# EAGLE design jphy_pwr.v1 (EAGLE 6.1)
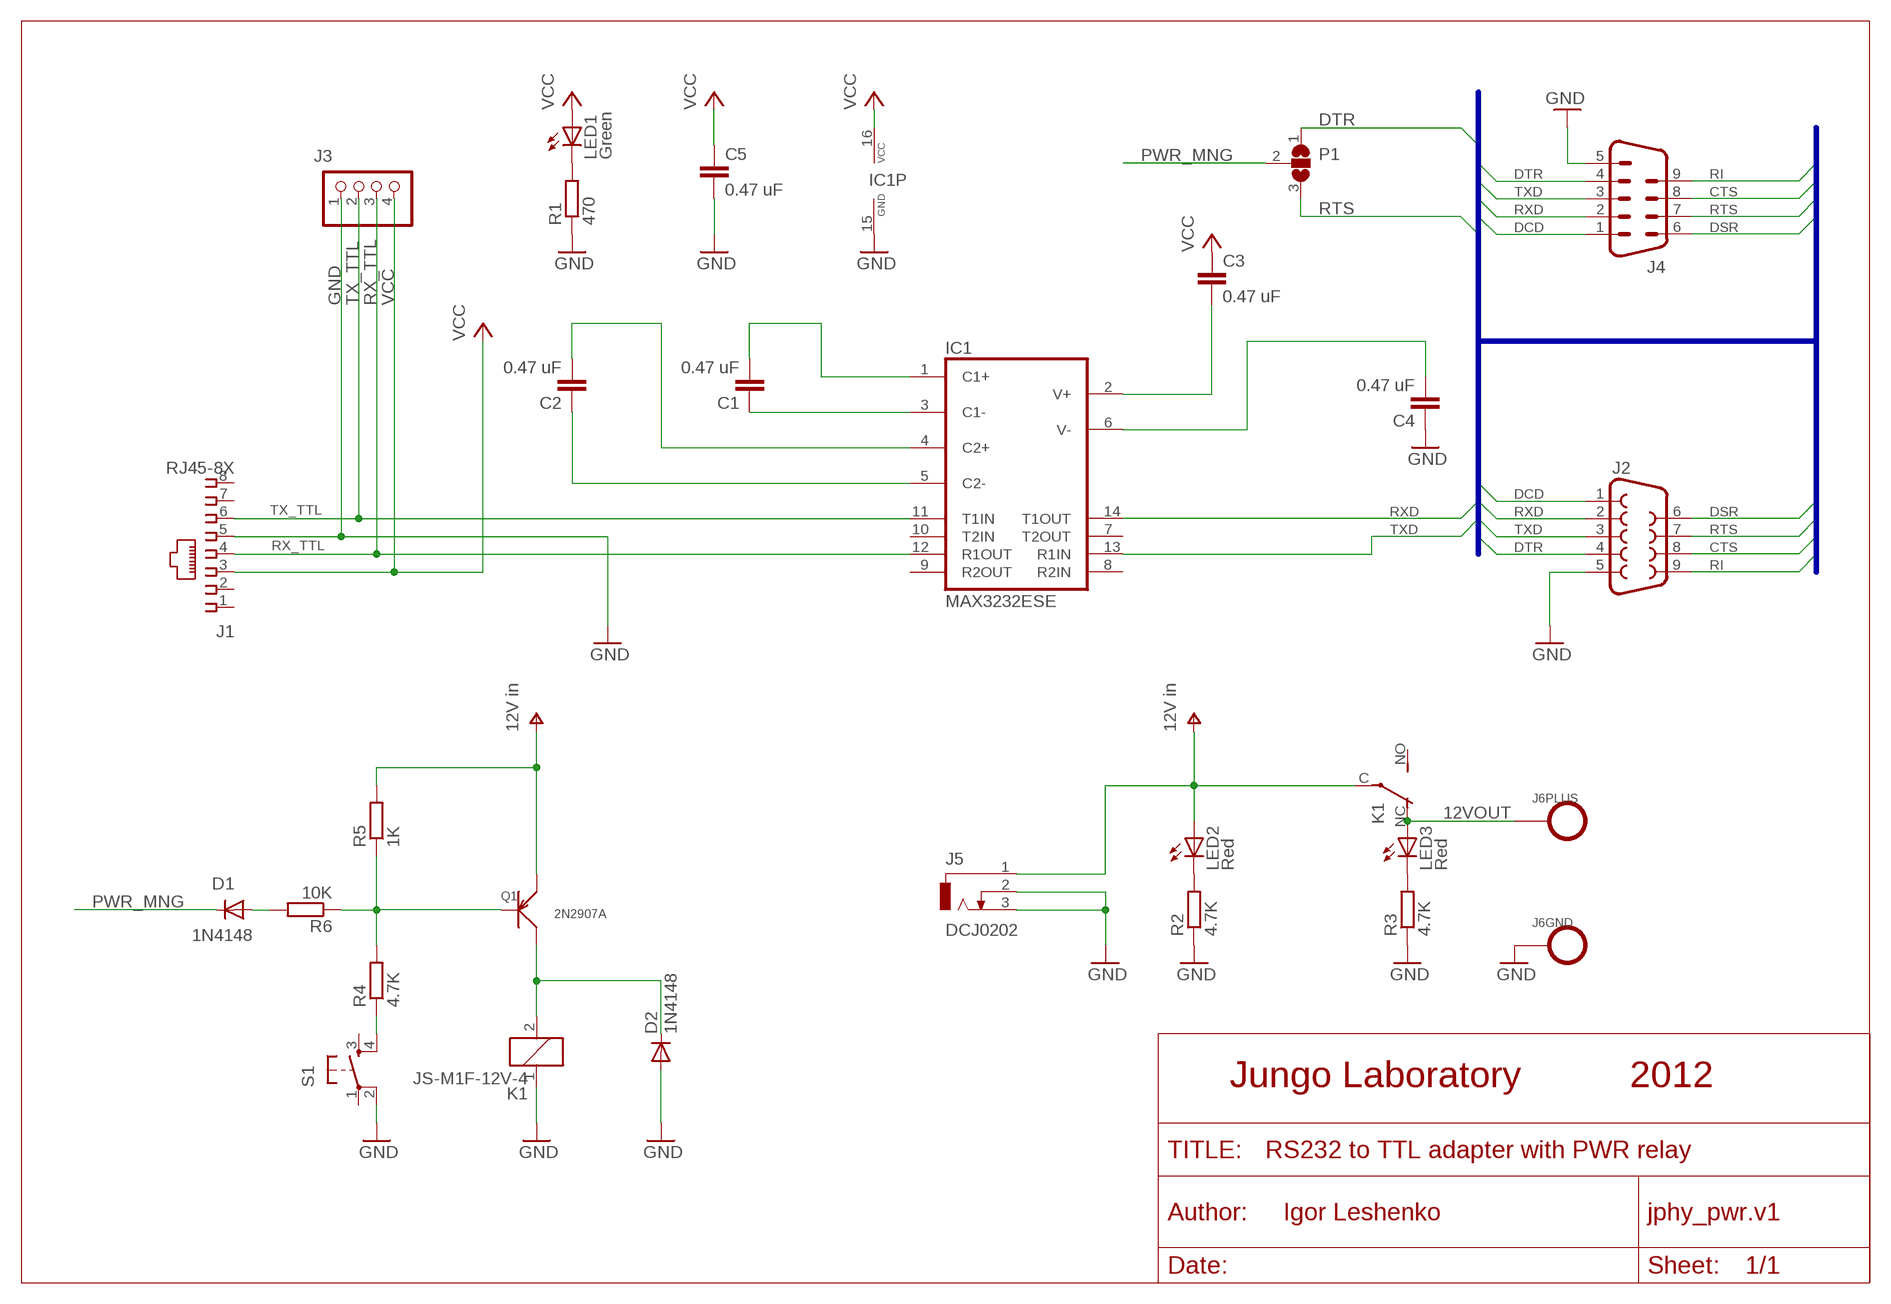
[diagram p0: schematic, sheet 1]

## Parts
C1  0.47 uF  C-EUC0805  [C0805]
C2  0.47 uF  C-EUC0805  [C0805]
C3  0.47 uF  C-EUC0805  [C0805]
C4  0.47 uF  C-EUC0805  [C0805]
C5  0.47 uF  C-EUC1206  [C1206]
D1  1N4148  DIODE-D-5  [D-5]
D2  1N4148  DIODE-D-5  [D-5]
IC1  MAX3232ESE  [SO16]
J1  RJ45-8X  [RJ45-NO-SHIELD]
J2  F09D  [F09D]
J3  PINHD-1X4  [1X04]
J4  M09D  [M09D]
J5  DCJ0202  [DCJ0202]
J6  POWER-OUT  [FLEX-POWER]
K1  JS-M1F-12V-4  [JS-M]
LED1  Green  LED3MM  [LED3MM]
LED2  Red  LED3MM  [LED3MM]
LED3  Red  LED3MM  [LED3MM]
P1  PAD-SOLDERJUMPER-2WAYT  [3P-SMD-4.8X2]
Q1  2N2907A  TRANSISTOR-PNP-TO-92  [TO-92-TRIANGLE]
R1  470  R-EU_0207/2V  [0207/2V]
R2  4.7K  R-EU_0207/2V  [0207/2V]
R3  4.7K  R-EU_0207/2V  [0207/2V]
R4  4.7K  R-EU_0207/2V  [0207/2V]
R5  1K  R-EU_0207/2V  [0207/2V]
R6  10K  R-EU_0207/2V  [0207/2V]
S1  TAC_SWITCHPTH  [TACTILE-PTH]

## Nets
12VOUT [power]: J6.1 K1.NC(2:O) LED3.A
+12V [power]: J5.1 K1.C(2:P) LED2.A Q1.1(E) R5.2 ; supply symbol labelled 12V in
CTS [wires]: J2.8 J4.8
DCD [wires]: J2.1 J4.1
DSR [wires]: J2.6 J4.6
DTR: J2.4 J4.4 P1.1
GND [power]: C4.1 C5.2 D2.A IC1.15(GND) J1.5 J2.5 J3.1 J4.5 J5.2 J5.3 J6.2 K1.1 R1.1 R2.1 R3.1 S1.2
N$1: LED1.K(C) R1.2
N$2: C3.2 IC1.2(V+)
N$3: C4.2 IC1.6(V-)
N$4: C1.1 IC1.3(C1-)
N$5: C1.2 IC1.1(C1+)
N$6: C2.1 IC1.5(C2-)
N$7: C2.2 IC1.4(C2+)
N$8: LED2.K(C) R2.2
N$9: LED3.K(C) R3.2
N$10: D2.C K1.2 Q1.3(C)
N$11: R4.1 S1.4
N$13: D1.A R6.2
N$14: Q1.2(B) R4.2 R5.1 R6.1
PWR_MNG: D1.C P1.2
RI [wires]: J2.9 J4.9
RTS: J2.7 J4.7 P1.3
RX_TTL: IC1.12(R1OUT) J1.4 J3.3
RXD: IC1.14(T1OUT) J2.2 J4.2
TX_TTL: IC1.11(T1IN) J1.6 J3.2
TXD: IC1.13(R1IN) J2.3 J4.3
VCC [power]: C3.1 C5.1 IC1.16(VCC) J1.3 J3.4 LED1.A
Unconnected: IC1.7(T2OUT) IC1.8(R2IN) IC1.9(R2OUT) IC1.10(T2IN) J1.1 J1.2 J1.7 J1.8 K1.NO(2:S) S1.1 S1.3

## Buses
DCD,RXD,TXD,DTR,DSR,RTS,CTS,RI

## Notes on the sheet
- 2012
- RS232 to TTL adapter with PWR relay
- Igor Leshenko

## Library data of the parts
C1-C5 = rcl:C-EU: CAPACITOR, European symbol
D1 D2 = diode:DIODE-: DIODE
IC1 = maxim:MAX3232*: True RS-232 Transceivers 3.0V to 5.5V, Low-Power up to 1Mbps, Using Four 0.1µF External Capacitors Source: http://pdfserv.maxim-ic.com/en/ds/MAX3222-MAX3241.pdf; MF: MAXIM; MPN: MAX3232ESE; OC_FARNELL: 9725539; OC_NEWARK: 79C3880
J1 = jlab:RJ45: CORCOM Modular RJ Jacks No Shield Source: www.tycoelectronics.com .. ENG_DS_1654001_1099_RJ_L_0507.pdf; MPN: RJ45-8X; OC_FARNELL: unknown; OC_NEWARK: 16R6101
J2 = con-subd:F09: SUB-D; OC_FARNELL: unknown; OC_NEWARK: unknown
J3 = pinhead:PINHD-1X4: PIN HEADER
J4 = jlab:M09: SUB-D; OC_FARNELL: unknown; OC_NEWARK: unknown
J5 = con-jack:DCJ0202: DC POWER JACK Source: DCJ0202.pdf; OC_FARNELL: unknown; OC_NEWARK: unknown
J6 = jlab:POWER-OUT
K1 = relay:JS-M1*: Automotive Ultra-Miniature Power Relay NAiS Source: http://www.mew-europe.com/.. en_ds_61211_0000.pdf; OC_FARNELL: unknown; OC_NEWARK: unknown
LED1-LED3 = led:LED: LED OSRAM: - CHIPLED LG R971, LG N971, LY N971, LG Q971, LY Q971, LO R971, LY R971 LH N974, LH R974 LS Q976, LO Q976, LY Q976 LO Q996 - Hyper CHIPLED LW Q18S LB Q993, LB Q99A, LB R99A - SideLED LS A670, LO A670, LY A670, LG A670, LP A670 LB A673, LV A673, LT A673, LW A673 LH A674 LY A675 LS A676, LA A676, LO A676, LY A676, LW A676 LS A679, LY A679, LG A679 - Hyper Micro SIDELED® LS Y876, LA Y876, LO Y876, LY Y876 LT Y87S - SmartLED LW L88C, LW L88S LB L89C, LB L89S, LG L890 LS L89K, LO L89K, LY L89K LS L896, LA L896, LO L896, LY L896 - TOPLED LS T670, LO T670, LY T670, LG T670, LP T670 LSG T670, LSP T670, LSY T670, LOP T670, LYG T670 LG T671, LOG T671, LSG T671 LB T673, LV T673, LT T673, LW T673 LH T674 LS T676, LA T676, LO T676, LY T676, LB T676, LH T676, LSB T676, LW T676 LB T67C, LV T67C, LT T67C, LS T67K, LO T67K, LY T67K, LW E67C LS E67B, LA E67B, LO E67B, LY E67B, LB E67C, LV E67C, LT E67C LW T67C LS T679, LY T679, LG T679 LS T770, LO T770, LY T770, LG T770, LP T770 LB T773, LV T773, LT T773, LW T773 LH T774 LS E675, LA E675, LY E675, LS T675 LS T776, LA T776, LO T776, LY T776, LB T776 LHGB T686 LT T68C, LB T68C - Hyper Mini TOPLED® LB M676 - Mini TOPLED Santana® LG M470 LS M47K, LO M47K, LY M47K Source: http://www.osram.convergy.de LUXEON: - LUMILED® LXK2-PW12-R00, LXK2-PW12-S00, LXK2-PW14-U00, LXK2-PW14-V00 LXK2-PM12-R00, LXK2-PM12-S00, LXK2-PM14-U00 LXK2-PE12-Q00, LXK2-PE12-R00, LXK2-PE12-S00, LXK2-PE14-T00, LXK2-PE14-U00 LXK2-PB12-K00, LXK2-PB12-L00, LXK2-PB12-M00, LXK2-PB14-N00, LXK2-PB14-P00, LXK2-PB14-Q00 LXK2-PR12-L00, LXK2-PR12-M00, LXK2-PR14-Q00, LXK2-PR14-R00 LXK2-PD12-Q00, LXK2-PD12-R00, LXK2-PD12-S00 LXK2-PH12-R00, LXK2-PH12-S00 LXK2-PL12-P00, LXK2-PL12-Q00, LXK2-PL12-R00 Source: www.luxeon.com KINGBRIGHT: KA-3528ASYC Source: www.kingbright.com
P1 = Discrete:PAD-SOLDERJUMPER-2WAY: Solder Jumper 2 way solder jumper
Q1 = Discrete:TRANSISTOR-PNP*: PNP audion
R1-R6 = rcl:R-EU_: RESISTOR, European symbol
S1 = SparkFun:TAC_SWITCH: Momentary Switch Button commonly used for reset or general input. Spark Fun Electronics SKU : COM-00097

## Net classes
0 default: width 0.254 mm, drill 0.5 mm, clearance 0.254 mm
1 power: width 0.813 mm, clearance 0.406 mm
2 wires: width 0.254 mm, clearance 0.254 mm

## Board
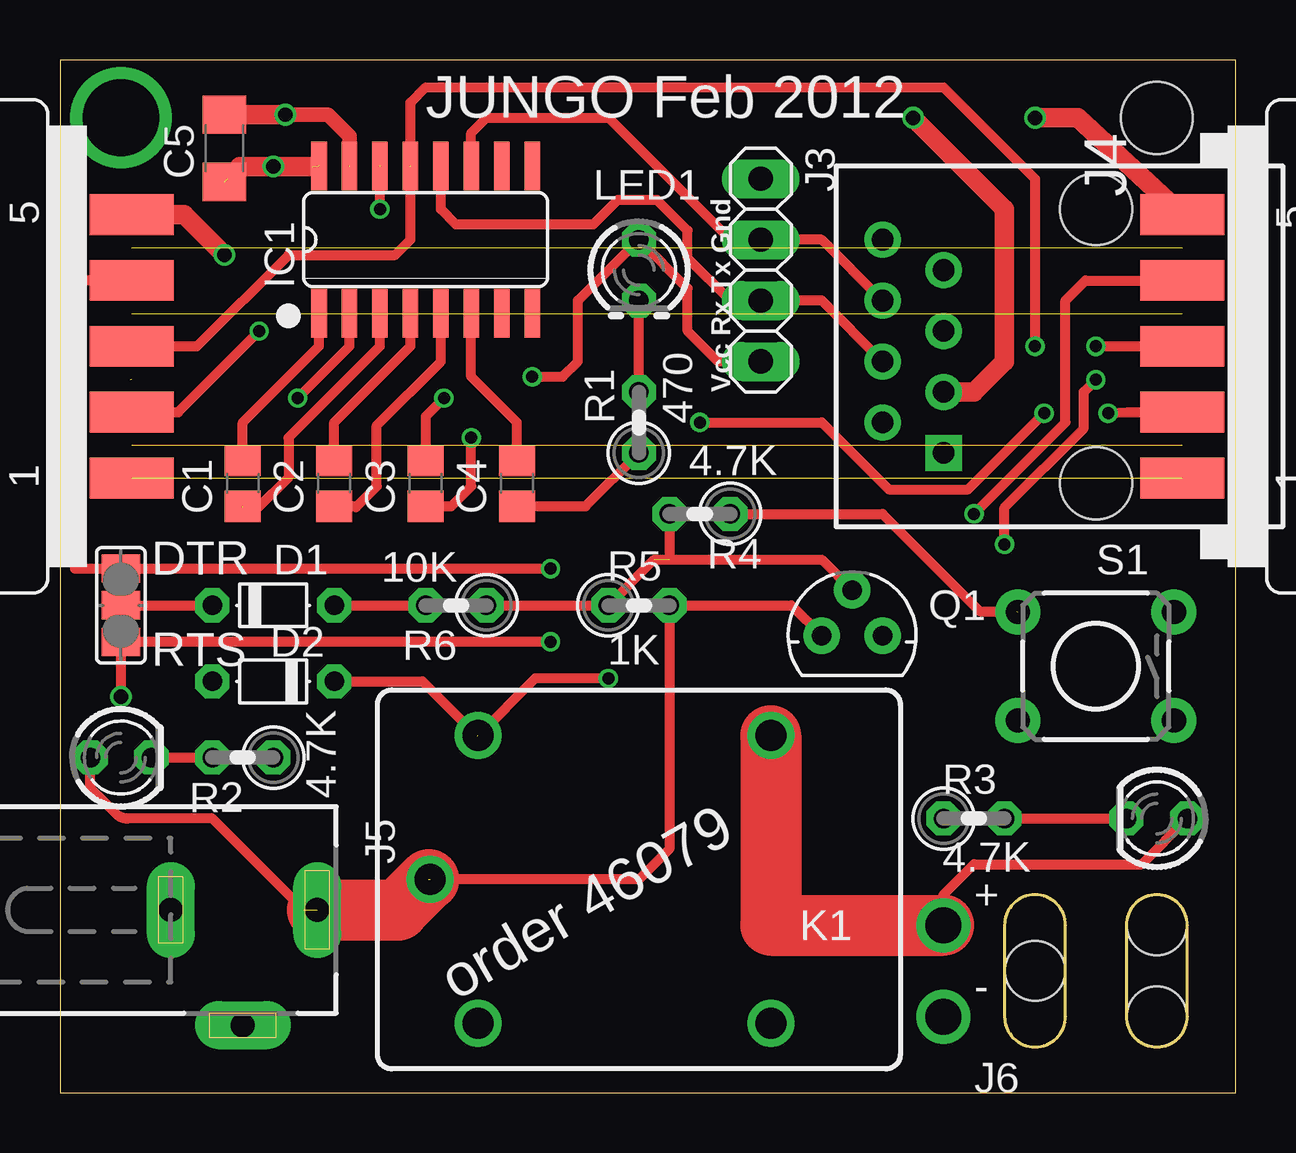
[diagram p1: board, top side]
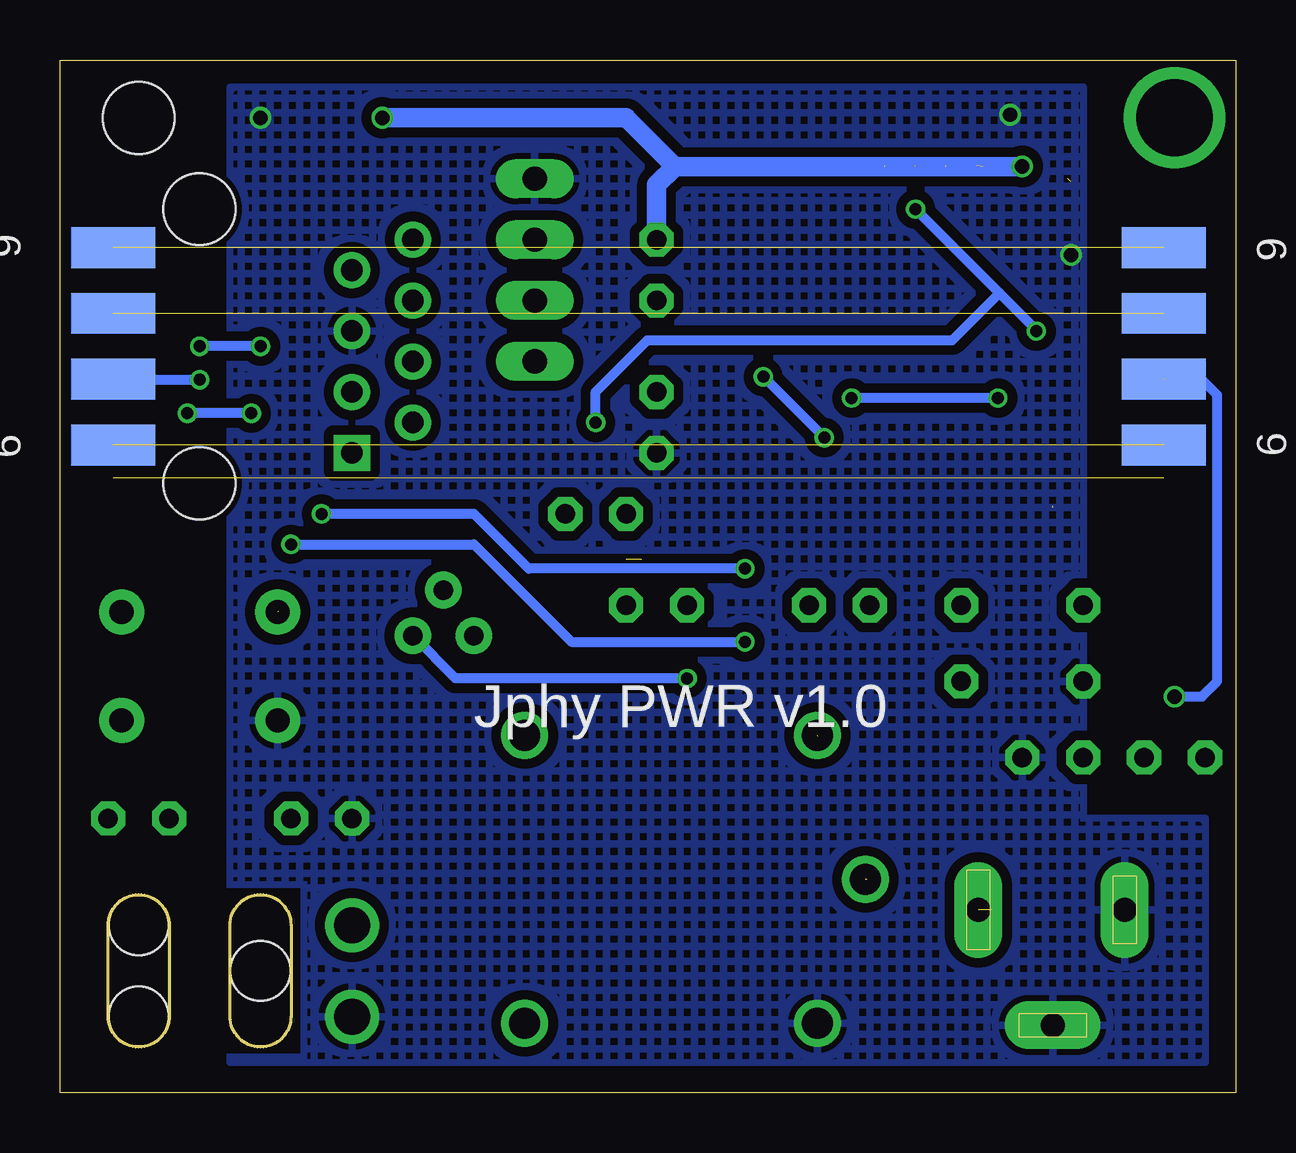
[diagram p2: board, bottom side, seen from below]

Size 49 x 43.05 mm. Coordinates in mm from the lower left corner, seen from the top.
Outline: 0,0 49,0 49,43.05 0,43.05 0,0
Copper layers (1*16): Top 0.035mm / dielectric 1.5mm / Bottom 0.035mm
Design rules: minimum track width 10mil, minimum drill 12mil, track to track 10mil, track to pad 10mil, pad to pad 10mil, via to via 10mil, smd to smd 0mil, copper to edge 10mil, drill to drill 10mil, minimum pad ring 12mil, minimum via ring 6mil, stop-mask expansion 2mil, vias tented up to drill 100mil, thermal gap 10mil
Holes 3 mm at 45.72,40.64

### Footprints (pad centres in the part's own frame; a part is rotated, then mirrored left to right if it is on the bottom)
C0805 = smd 1.3 x 1.5: 1 -0.95,0; 2 0.95,0
C1206 = smd 1.6 x 1.8: 1 -1.4,0; 2 1.4,0
D-5 = drill 0.813 octagon: A 2.54,0; C -2.54,0
SO16 = smd 0.66 x 2.032: 1 -4.445,-3.073; 2 -3.175,-3.073; 3 -1.905,-3.073; 4 -0.635,-3.073; 5 0.635,-3.073; 6 1.905,-3.073; 7 3.175,-3.073; 8 4.445,-3.073; 9 4.445,3.073; 10 3.175,3.073; 11 1.905,3.073; 12 0.635,3.073; 13 -0.635,3.073; 14 -1.905,3.073; 15 -3.175,3.073; 16 -4.445,3.073
RJ45-NO-SHIELD = drill 0.9 pad 1.4 square: 1 -4.445,6.35 | drill 0.9 pad 1.4: 2 -3.175,8.89; 3 -1.905,6.35; 4 -0.635,8.89; 5 0.635,6.35; 6 1.905,8.89; 7 3.175,6.35; 8 4.445,8.89 | hole 3: -5.715,0; 5.715,0
F09D = smd 1.7 x 3.5: 1 -5.486,-6.045; 2 -2.743,-6.045; 3 0,-6.045; 4 2.743,-6.045; 5 5.486,-6.045 | smd 1.7 x 3.5 bottom: 6 -4.115,-6.045; 7 -1.372,-6.045; 8 1.372,-6.045; 9 4.115,-6.045
1X04 = drill 1.016 long: 1 -3.81,0; 2 -1.27,0; 3 1.27,0; 4 3.81,0
M09D = smd 1.7 x 3.5: 1 5.486,-6.045; 2 2.743,-6.045; 3 0,-6.045; 4 -2.743,-6.045; 5 -5.486,-6.045 | smd 1.7 x 3.5 bottom: 6 4.115,-6.045; 7 1.372,-6.045; 8 -1.372,-6.045; 9 -4.115,-6.045
DCJ0202 = drill 1 pad 2 long: 1 0,3.1; 2 4.8,0; 3 0,-3
FLEX-POWER = drill 1.5: 1 -2.54,1.905; 2 -2.54,-1.905 | hole 2.5: 6.35,1.905; 1.27,0; 6.35,-1.905
JS-M = drill 1.3: 1 6.7,6; 2 6.7,-6; C 8.7,0; NC -5.5,-6; NO -5.5,6
LED3MM = drill 0.813 octagon: A -1.27,0; K 1.27,0
3P-SMD-4.8X2 = smd 1.168 x 1.6: 1 -1.524,0; 2 0,0; 3 1.524,0
TO-92-TRIANGLE = drill 0.813 pad 1.524: 1 -1.27,0; 2 0,1.905; 3 1.27,0
0207/2V = drill 0.813 octagon: 1 -1.27,0; 2 1.27,0
TACTILE-PTH = drill 1.016 pad 1.88: 1 -3.251,2.261; 2 3.251,2.261; 3 -3.251,-2.261; 4 3.251,-2.261

### Placement (x,y rotation side)
C1  7.62,25.4 90 top
C2  11.43,25.4 90 top
C3  15.24,25.4 90 top
C4  19.05,25.4 90 top
C5  6.86,39.37 90 top
D1  8.89,20.32 0 top
D2  8.89,17.14 180 top
IC1  15.24,35.56 0 top
J1  43.18,31.11 90 top
J2  -3.05,31.11 90 top
J3  29.21,34.29 270 top
J4  52.83,31.11 270 top
J5  7.62,7.62 270 top
J6  39.37,5.08 0 top
K1  24.13,8.89 180 top
LED1  24.13,34.29 270 top
LED2  2.54,13.97 0 top
LED3  45.72,11.43 180 top
P1  2.54,20.32 270 top
Q1  33.02,19.05 0 top
R1  24.13,27.94 90 top
R2  7.62,13.97 180 top
R3  38.1,11.43 0 top
R4  26.67,24.13 180 top
R5  24.13,20.32 0 top
R6  16.51,20.32 180 top
S1  43.18,17.78 180 top

### Tracks (layer width: path | path; a pad name or v marks a point on that pad's centre or on a via)
12VOUT
  Top 0.406: J6.1 36.83,8.26 38.1,9.53 45.09,9.53 LED3.A
  Top 2.54: K1.NC 29.63,6.99 J6.1
+12V  (2 unrouted)
  Top 0.406: 10.16,7.62 6.35,11.43 2.8,11.43 arc-45 2.35,11.62 1.27,12.7 LED2.A | K1.C 24.13,8.89 25.4,10.16 R5.2 30.48,20.32 Q1.1
  Top 2.54: J5.1 14.1,7.62 15.37,8.89
CTS  (1 unrouted)
DCD  (1 unrouted)
DSR  (1 unrouted)
DTR  (via drill 0.5)
  Top 0.406: J2.4 0.64,33.86 0.64,21.84 P1.1 v20.45,21.84 | v38.1,24.13 41.91,27.94 41.91,33.02 42.75,33.86 J4.4
  Bottom 0.406: v20.45,21.84 29.46,21.84 31.75,24.13 v38.1,24.13
GND  (via drill 0.6)  (1 unrouted)
  Top 0.406: C4.1 21.91,24.45 R1.1
  Top 0.61: v9.4,40.77 11.18,40.77 12.06,39.88 12.06,38.61
  Top 0.813: J2.5 5.18,36.6 v6.86,34.92 | J4.5 42.42,40.64 v40.64,40.64 | C5.2 v9.39,40.77 v9.4,40.77
  pour Bottom (hatched): 6.35,41.91 6.35,11.43 1.27,11.43 1.27,1.27 41.91,1.27 41.91,41.91
N$1
  Top 0.406: R1.2 LED1.K
N$2  (via drill 0.5)
  Top 0.406: v16,28.96 15.24,28.19 C3.2 | v9.91,28.96 12.06,31.11 IC1.2
  Bottom 0.406: v9.91,28.96 v16,28.96
N$3
  Top 0.406: IC1.6 17.14,29.84 19.05,27.94 C4.2
N$4  (1 unrouted)
  Top 0.406: IC1.3 13.34,31.11 9.53,27.3 9.53,25.65 8.26,24.38 7.62,24.38
N$5
  Top 0.406: C1.2 7.62,27.94 10.79,31.11 IC1.1
N$6
  Top 0.406: 12.34,24.4 12.38,24.45 | IC1.5 15.88,30.48 13.21,27.81 13.21,25.27 12.38,24.45 | C2.1 12.38,24.45
N$7
  Top 0.406: C2.2 11.43,27.94 14.61,31.11 IC1.4
N$8
  Top 0.406: LED2.K R2.2
N$9
  Top 0.406: R3.2 LED3.K
N$10  (via drill 0.5)  (1 unrouted)
  Top 0.406: D2.C 15.11,17.14 17.4,14.86 19.81,17.27 v22.86,17.27
  Bottom 0.406: v22.86,17.27 32.51,17.27 Q1.3
N$11  (1 unrouted)
  Top 0.406: R4.1 34.29,24.13 38.35,20.07 39.88,20.07
N$13
  Top 0.406: D1.A R6.2
N$14  (1 unrouted)
  Top 0.406: R6.1 R5.1 24.77,22.23 31.75,22.23 Q1.2 | R4.2 25.4,22.23
N$155  (via drill 3.2)
  other vias: 2.54,40.64
PWR_MNG
  Top 0.406: P1.2 D1.C
RI  (1 unrouted)
RTS  (via drill 0.5, 0.6)  (1 unrouted)
  Top 0.406: v2.54,16.51 P1.3 v20.45,18.8 | v39.37,22.86 39.37,24.38 42.67,27.69 42.67,29.21 v43.18,29.72
  Bottom 0.406: v2.54,16.51 1.4,16.51 0.76,17.14 0.76,29.08 1.4,29.72 2.92,29.72 | J4.7 46.76,29.72 v43.18,29.72 | v39.37,22.86 31.75,22.86 27.69,18.8 v20.45,18.8
RX_TTL
  Top 0.406: IC1.12 15.88,36.83 16.51,36.2 22.23,36.2 23.24,37.21 24.89,37.21 26.16,35.94 26.16,34.8 27.94,33.02 J3.3 31.75,33.02 J1.4
RXD  (via drill 0.5)  (1 unrouted)
  Top 0.406: v8.31,31.75 4.93,28.37 J2.2 | v13.34,36.83 13.34,38.61 | v26.67,27.94 31.75,27.94 34.54,25.15 37.85,25.15 v41.02,28.32 | v43.69,28.32 44.5,28.37 J4.2
  Bottom 0.406: v8.31,31.75 8.26,31.75 9.84,33.34 | 9.84,33.34 v13.34,36.83 | v41.02,28.32 v43.69,28.32 | v26.67,27.94 26.67,29.21 24.51,31.37 11.81,31.37 9.84,33.34
TX_TTL
  Top 0.406: J1.6 31.75,35.56 J3.2 27.94,35.56 22.86,40.64 17.78,40.64 17.14,40.01 IC1.11
TXD  (via drill 0.5)  (1 unrouted)
  Top 0.406: J2.3 5.71,31.11 9.53,34.92 13.97,34.92 14.61,35.56 14.61,38.61 | IC1.13 14.61,41.27 15.24,41.91 36.83,41.91 40.64,38.1 v40.64,31.11 | v43.18,31.11 J4.3
  Bottom 0.406: v40.64,31.11 v43.18,31.11
VCC  (via drill 0.5, 0.6)  (2 unrouted)
  Top 0.406: C3.1 16.32,24.45 17.14,25.27 v17.14,27.3 | v19.68,29.84 20.95,29.84 21.59,30.48 21.59,33.02 LED1.A 26.16,33.53 26.16,31.75 27.43,30.48 J3.4
  Top 0.813: J1.3 38.1,29.21 39.37,30.48 39.37,36.83 v35.56,40.64 | 10.54,38.61 v8.89,38.61 7.49,38.61 6.99,38.1
  Bottom 0.406: v17.14,27.3 v19.68,29.84
  Bottom 0.813: v35.56,40.64 25.4,40.64 23.37,38.61 | 23.37,38.61 v8.89,38.61 | LED1.A 24.13,37.85 23.37,38.61

### Text on the board
tPlace: DTR | RTS
tNames: JUNGO Feb 2012 | Vcc Rx Tx Gnd | order 46079
bNames: Jphy PWR v1.0